# EAGLE schematic dob (EAGLE 9.6.2)
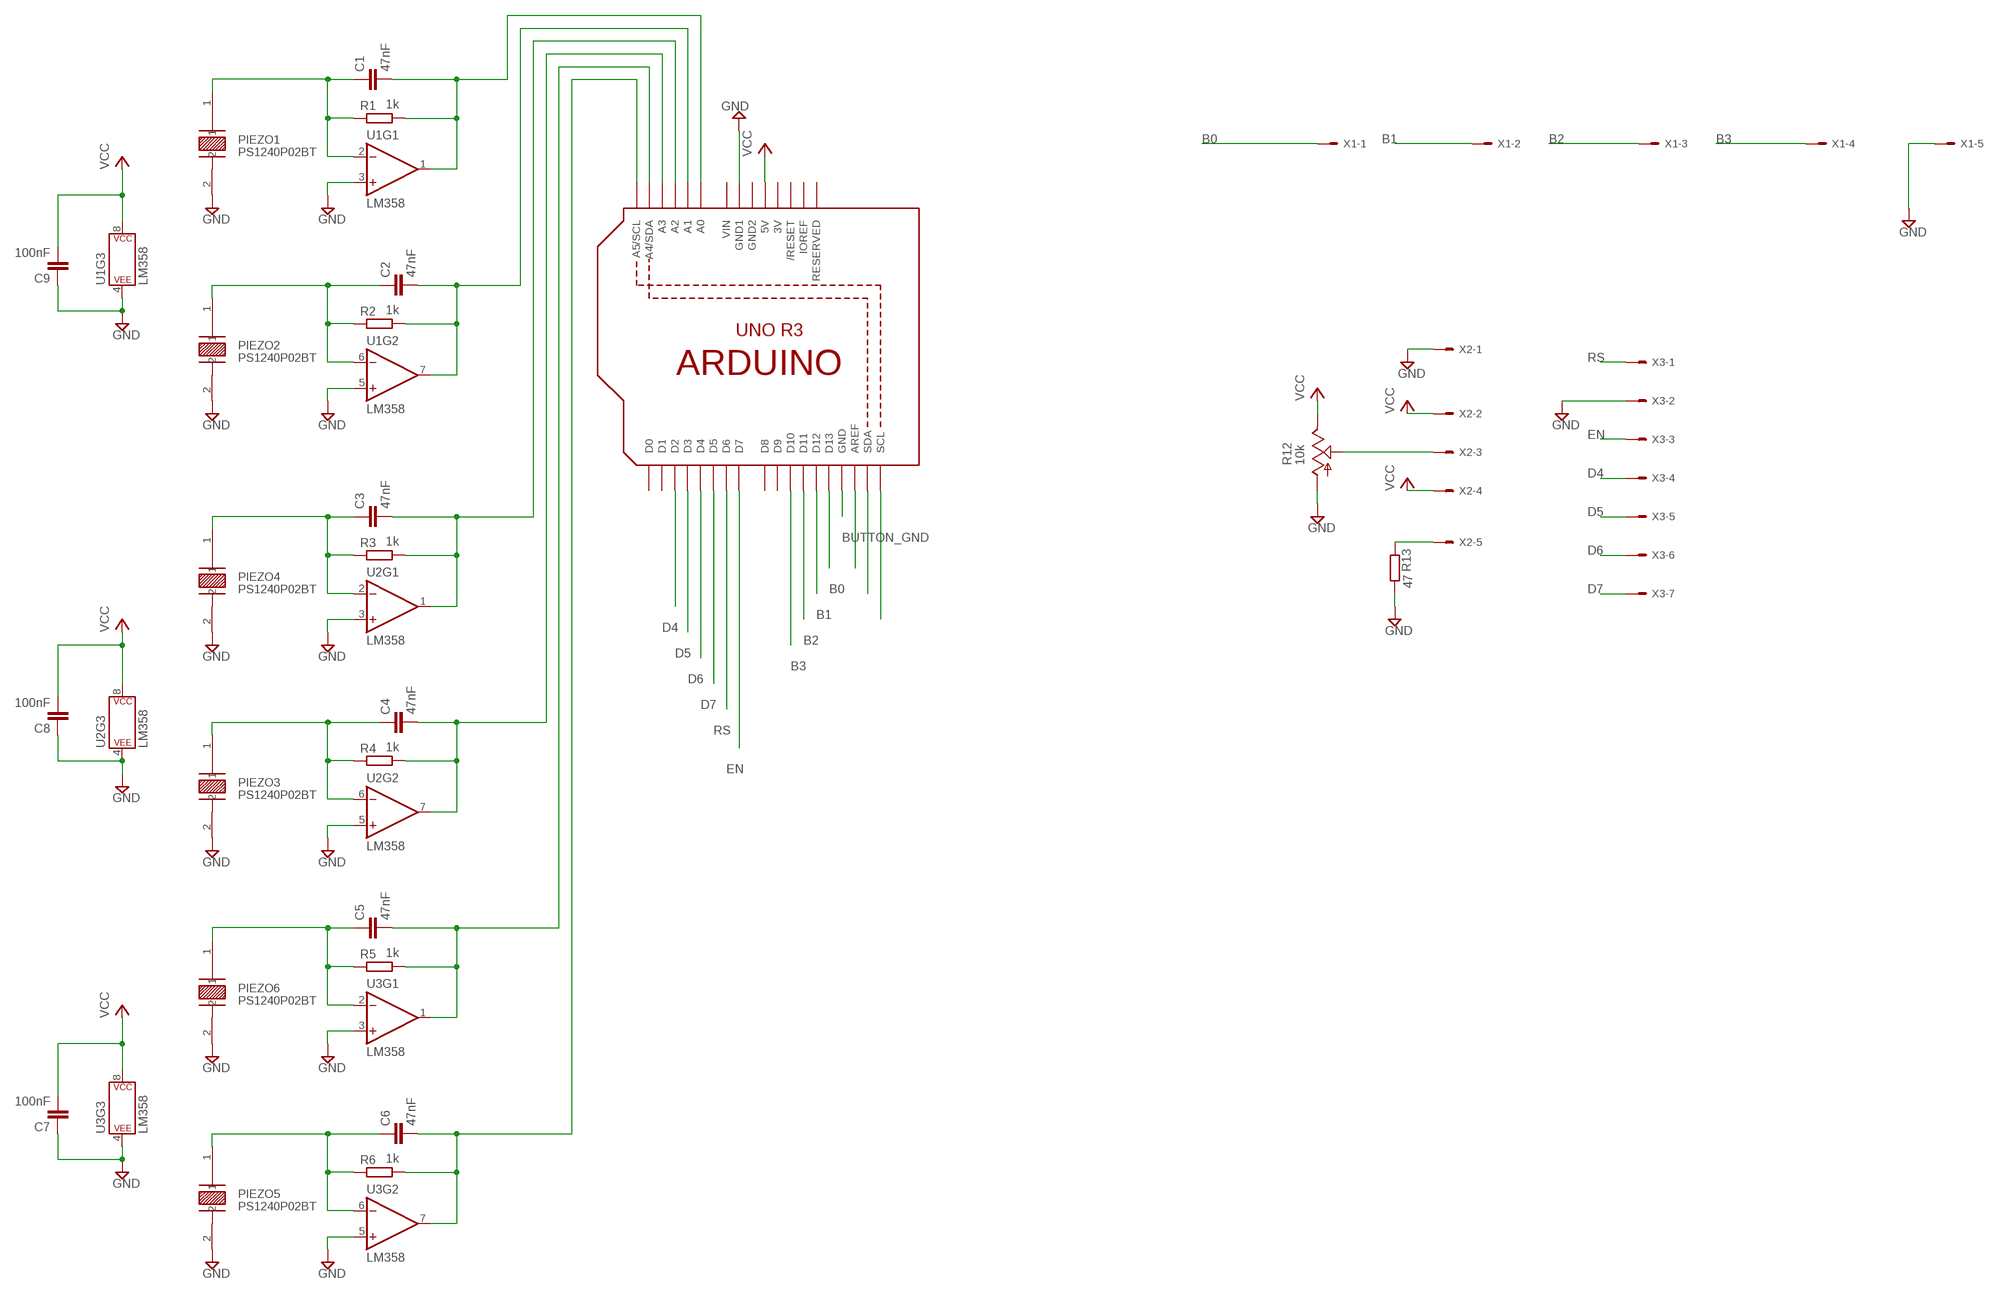
[diagram p0: schematic, sheet 1]

## Parts
ATMEGA4809  ARDUINOR3-DIMENSION  [ARDUINOR3]
C1  47nF  C-EU050-035X075  [C050-035X075]
C2  47nF  C-EU050-035X075  [C050-035X075]
C3  47nF  C-EU050-035X075  [C050-035X075]
C4  47nF  C-EU050-035X075  [C050-035X075]
C5  47nF  C-EU050-035X075  [C050-035X075]
C6  47nF  C-EU050-035X075  [C050-035X075]
C7  100nF  C-EU050-035X075  [C050-035X075]
C8  100nF  C-EU050-035X075  [C050-035X075]
C9  100nF  C-EU050-035X075  [C050-035X075]
PIEZO1  PS1240P02BT  [PS1240P02BT]
PIEZO2  PS1240P02BT  [PS1240P02BT]
PIEZO3  PS1240P02BT  [PS1240P02BT]
PIEZO4  PS1240P02BT  [PS1240P02BT]
PIEZO5  PS1240P02BT  [PS1240P02BT]
PIEZO6  PS1240P02BT  [PS1240P02BT]
R1  1k  R-EU_0204/7  [0204/7]
R2  1k  R-EU_0204/7  [0204/7]
R3  1k  R-EU_0204/7  [0204/7]
R4  1k  R-EU_0204/7  [0204/7]
R5  1k  R-EU_0204/7  [0204/7]
R6  1k  R-EU_0204/7  [0204/7]
R12  10k  TRIM_US-B25P  [B25P]
R13  47  R-EU_0204/7  [0204/7]
U1  LM358  LM358KIT  [DIP08-KIT]
U2  LM358  LM358KIT  [DIP08-KIT]
U3  LM358  LM358KIT  [DIP08-KIT]
X1  KK-156-5  [KK-156-5]
X2  KK-156-5  [KK-156-5]
X3  KK-156-7  [KK-156-7]

## Nets
B0: ATMEGA4809.D13 X1.1
B1: ATMEGA4809.D12 X1.2
B2: ATMEGA4809.D11 X1.3
B3: ATMEGA4809.D10 X1.4
BUTTON_GND: ATMEGA4809.GND
D4: ATMEGA4809.D2 X3.4
D5: ATMEGA4809.D3 X3.5
D6: ATMEGA4809.D4 X3.6
D7: ATMEGA4809.D5 X3.7
EN: ATMEGA4809.D7 X3.3
GND: ATMEGA4809.GND1 C7.1 C8.1 C9.1 PIEZO1.2 PIEZO2.2 PIEZO3.2 PIEZO4.2 PIEZO5.2 PIEZO6.2 R12.A R13.2 U1.3(+IN) U1.4(P$V-) U1.5(+IN) U2.3(+IN) U2.4(P$V-) U2.5(+IN) U3.3(+IN) U3.4(P$V-) U3.5(+IN) X1.5 X2.1 X3.2
N$1: C1.1 PIEZO1.1 R1.1 U1.2(-IN)
N$2: ATMEGA4809.A0 C1.2 R1.2 U1.1(OUT)
N$3: C2.1 PIEZO2.1 R2.1 U1.6(-IN)
N$4: ATMEGA4809.A1 C2.2 R2.2 U1.7(OUT)
N$6: C3.1 PIEZO4.1 R3.1 U2.2(-IN)
N$7: ATMEGA4809.A2 C3.2 R3.2 U2.1(OUT)
N$8: C4.1 PIEZO3.1 R4.1 U2.6(-IN)
N$9: ATMEGA4809.A3 C4.2 R4.2 U2.7(OUT)
N$12: C5.1 PIEZO6.1 R5.1 U3.2(-IN)
N$13: ATMEGA4809.A4(A4/SDA) C5.2 R5.2 U3.1(OUT)
N$14: C6.1 PIEZO5.1 R6.1 U3.6(-IN)
N$15: ATMEGA4809.A5(A5/SCL) C6.2 R6.2 U3.7(OUT)
N$18: R12.S X2.3
N$19: R13.1 X2.5
N$24: ATMEGA4809.AREF ATMEGA4809.SCL ATMEGA4809.SDA
RS: ATMEGA4809.D6 X3.1
VCC: ATMEGA4809.5V C7.2 C8.2 C9.2 R12.E U1.8(P$V+) U2.8(P$V+) U3.8(P$V+) X2.2 X2.4
Unconnected: ATMEGA4809.D0 ATMEGA4809.D1 ATMEGA4809.D8 ATMEGA4809.D9 ATMEGA4809.IOREF ATMEGA4809.RESERVED ATMEGA4809.RESET(/RESET)

## Power pins joined to a net without a drawn wire
3V: ATMEGA4809.3V
GND2: ATMEGA4809.GND2
VIN: ATMEGA4809.VIN

## Library data of the parts
ATMEGA4809 = adafruit:ARDUINOR3: This is a new object for the new Arduino R3 - with extra pins that you may want to use (such as IOref, and duplicated A4/A5
C1-C9 = resistor:C-EU: CAPACITOR, European symbol
PIEZO1-PIEZO6 = Microphone:PS1240P02BT: AUDIO PIEZO TRANSDUCER 30V TH Manufacturer's datasheet <https://product.tdk.com/info/en/catalog/datasheets/piezoelectronic_buzzer_ps_en.pdf?ref_disty=digikey>; CREATED_BY: PCBLayout.com; DIGIKEY_PARTNO: 445-2525-3-ND; MANUFACTURER: TDK Corporation; MPN: PS1240P02BT
R1-R6 R13 = rcl:R-EU_: RESISTOR, European symbol; SPICEPREFIX: R
R12 = pot:TRIM_US-: POTENTIOMETER
U1-U3 = SparkFun-IC-Amplifiers:LM358: LM358 Jellybean op-amp Datasheet <http://www.sparkfun.com/datasheets/Components/General/LM358.pdf> SparkFun Products Op-Amp (Thru-Hole) - LM358 <https://www.sparkfun.com/products/9456> (COM-09456); PROD_ID: IC-09172
X1 X2 = con-molex:KK-156-5: KK 156 HEADER Source: http://www.molex.com/pdm_docs/sd/026604100_sd.pdf; MF: MOLEX; OC_FARNELL: unknown; OC_NEWARK: unknown
X3 = con-molex:KK-156-7: KK 156 HEADER Source: http://www.molex.com/pdm_docs/sd/026604100_sd.pdf; MF: MOLEX; OC_FARNELL: unknown; OC_NEWARK: unknown